# EasyEDA schematic SCH_TS Pico v0.1.json
TITLE: TS Pico - Circuito principal; REV: 0.1; Date: 2022-04-04; Sheet: 1/1; Drawn By: Ricardo Calcagno; Company: .
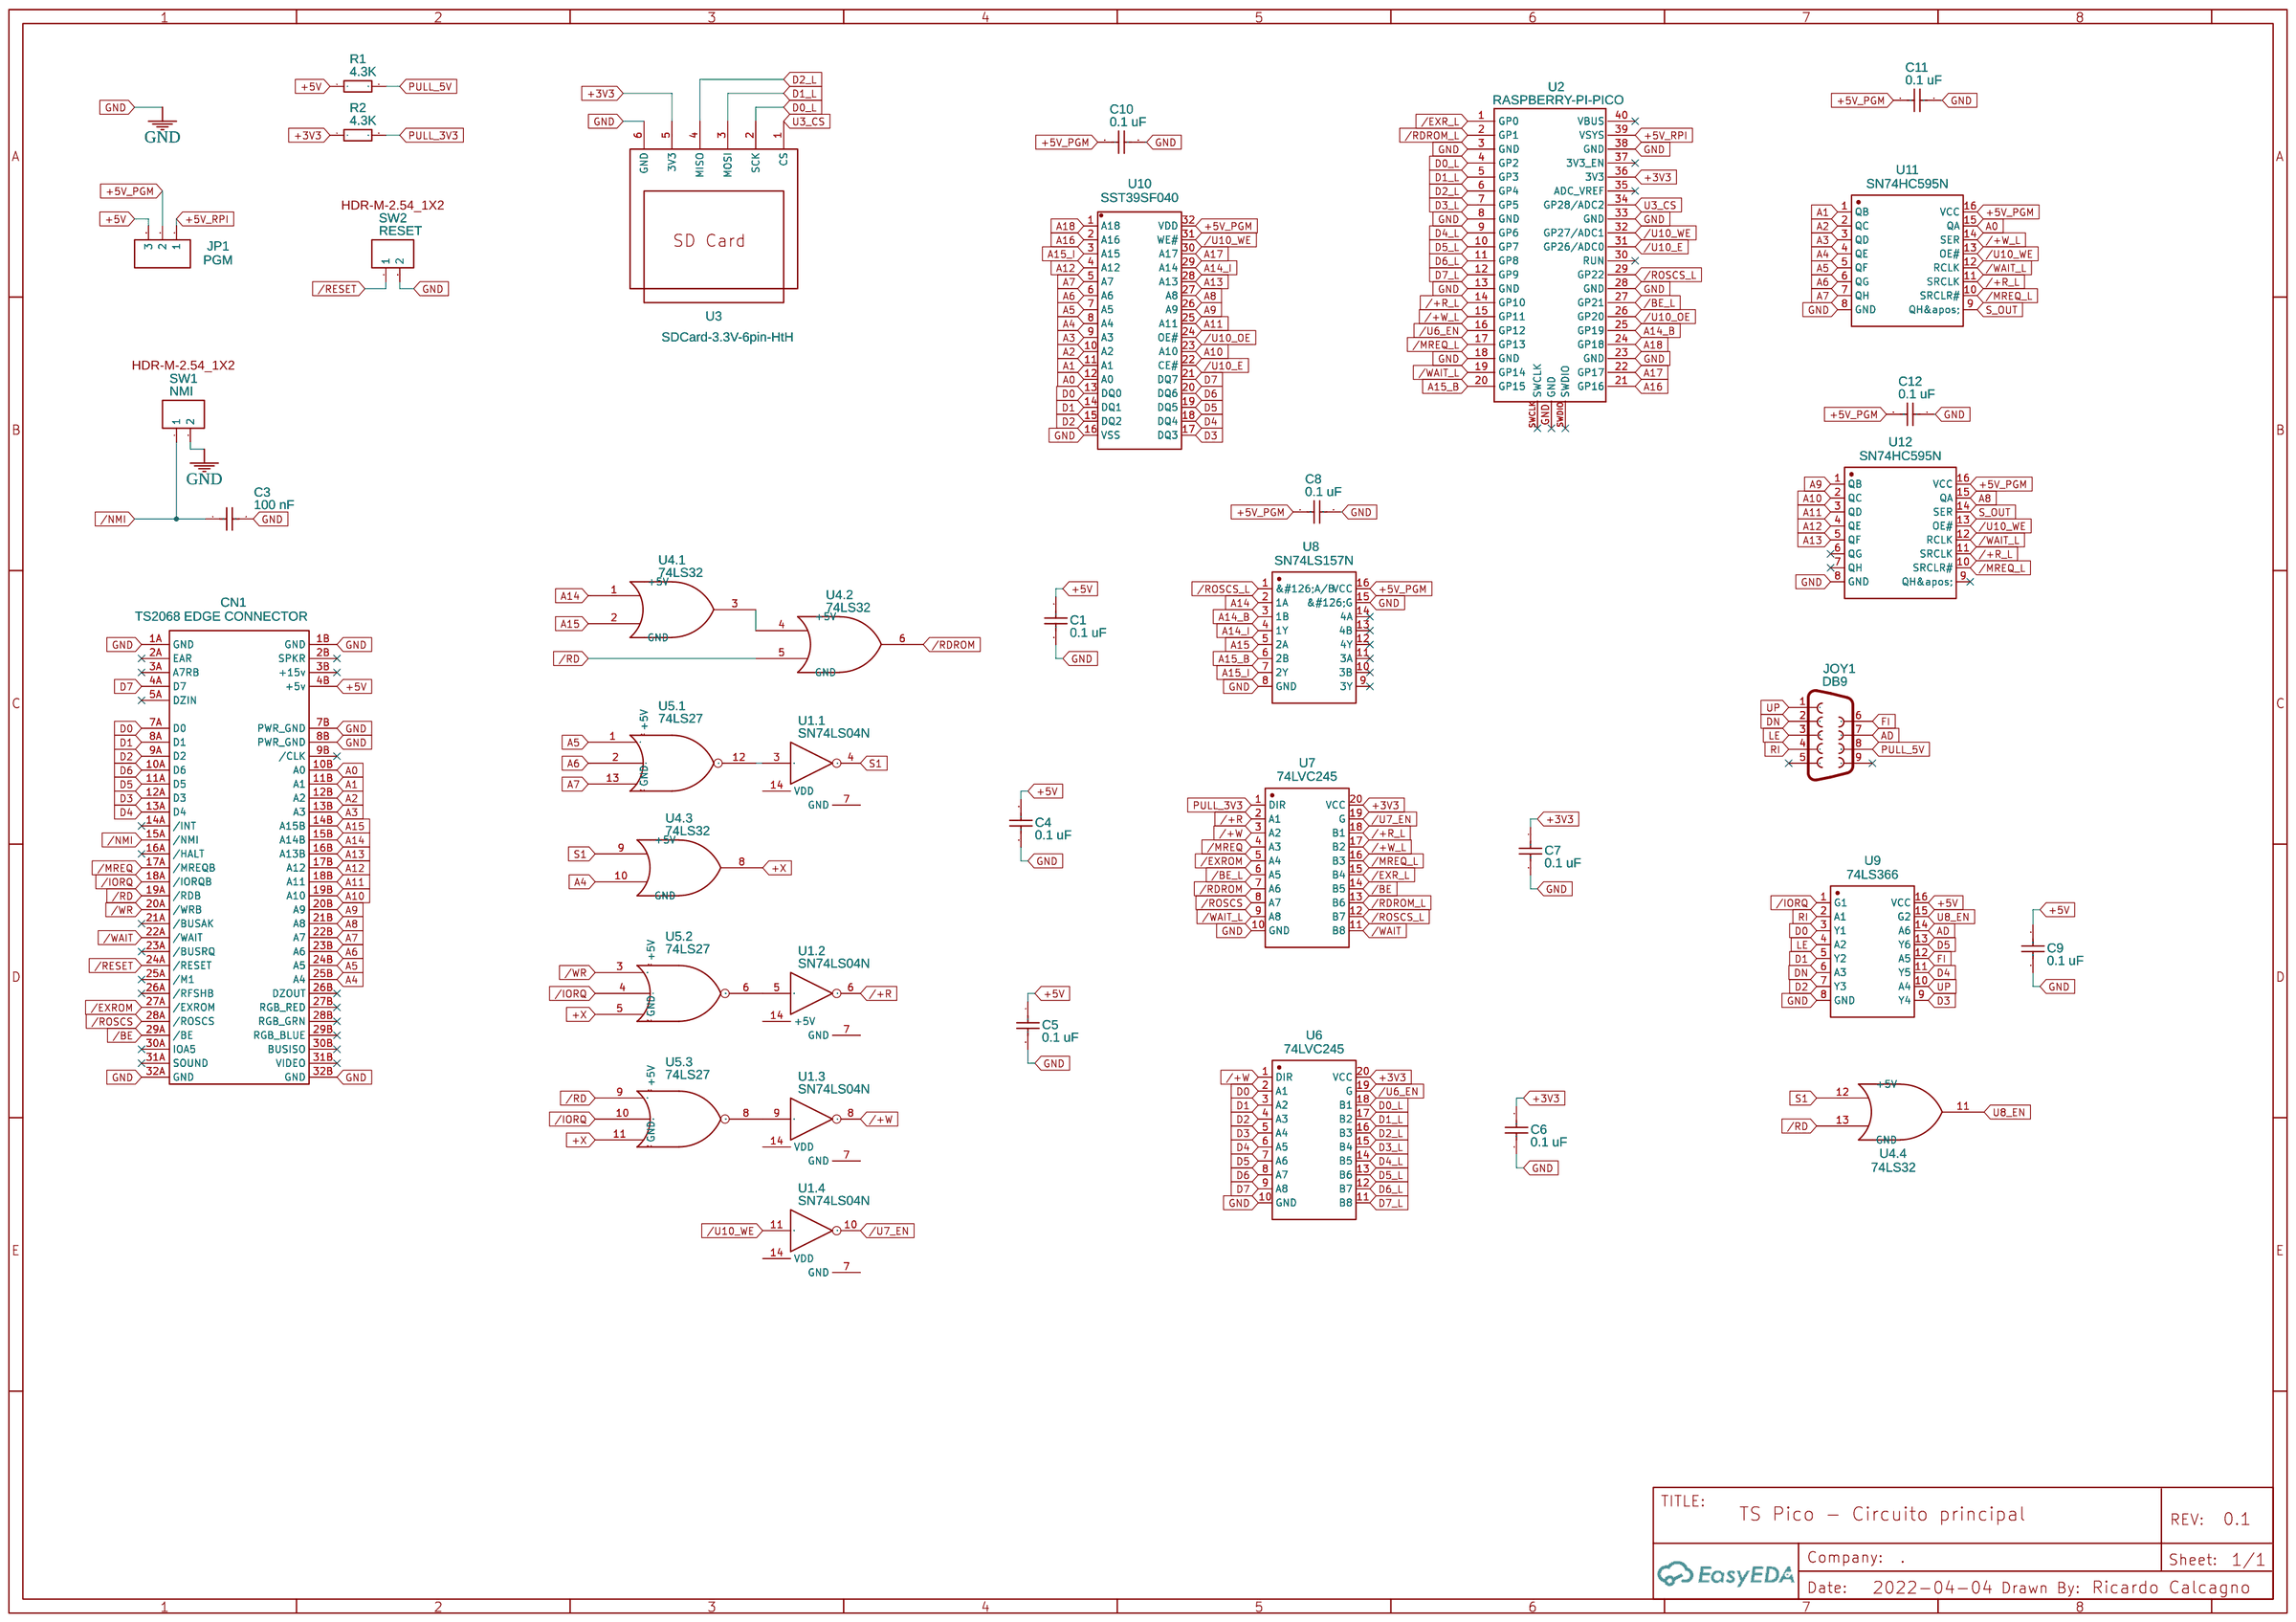
[diagram p0: schematic sheet]

## Parts
C1  0.1 uF  [0.1UF, 50V CAPACITOR]
C3  100 nF  [0.1UF, 50V CAPACITOR]
C4  0.1 uF  [0.1UF, 50V CAPACITOR]
C5  0.1 uF  [0.1UF, 50V CAPACITOR]
C6  0.1 uF  [0.1UF, 50V CAPACITOR]
C7  0.1 uF  [0.1UF, 50V CAPACITOR]
C8  0.1 uF  [0.1UF, 50V CAPACITOR]
C9  0.1 uF  [0.1UF, 50V CAPACITOR]
C10  0.1 uF  [0.1UF, 50V CAPACITOR]
C11  0.1 uF  [0.1UF, 50V CAPACITOR]
C12  0.1 uF  [0.1UF, 50V CAPACITOR]
CN1  TS2068 EDGE CONNECTOR  [CONECTOR TS2068 ROTULADO]
JOY1  DB9  [DB9_MALE]
JP1  PGM  [HDR-M-2.54_1X3]
R1  4.3K  [AXIAL-0.3]
R2  4.3K  [AXIAL-0.3]
SW1  NMI  [HDR-M-2.54_1X2]
SW2  RESET  [HDR-M-2.54_1X2]
U1  SN74LS04N  [DIP14]  (sections 1,2,3,4)
U2  RASPBERRY-PI-PICO  [FT_RASPBERRY-PI-PICO_TH]
U3  SDCard-3.3V-6pin-HtH  [SDCARD-3.,3V-6PIN-HTH]
U4  74LS32  [DIP-14_L17.8-W10.2-P2.54-BL]  (sections 1,2,3,4)
U5  74LS27  [DIP-14_L17.8-W10.2-P2.54-BL]  (sections 1,2,3)
U6  74LVC245  [74LVC245]
U7  74LVC245  [74LVC245]
U8  SN74LS157N  [PDIP-16]
U9  74LS366  [DIP16]
U10  SST39SF040  [DIP32]
U11  SN74HC595N  [DIP-16_L19.8-W6.5-P2.54-LS7.6-BL]
U12  SN74HC595N  [DIP-16_L19.8-W6.5-P2.54-LS7.6-BL]

## Library data of the parts
C1 C3-C12 = Capacitor 10uF (1206): Manufacturer Part: New SchematicLib; Contributor: mpayne002; Package Display: No
CN1 = TS2068 EDGE CONNECTOR - STRAIGHT: Manufacturer: TE Connectivity; Manufacturer Part: 1761468-1; Supplier: Digi-Key; Supplier Part: A102052-ND; link: https://www.digikey.com/product-detail/en/te-connectivity-amp-connectors/1761468-1/A102052-ND/2310803; Contributor: factus10; Package Display: No
JOY1 = DB9: Contributor: SparkFun
JP1 = HDR-M-2.54_1x3: Supplier Part: C180248; Supplier: LCSC; Contributor: LCEDA_Lib
R1 R2 = CF1/6W-4.3KΩ±5% T52: Supplier: LCSC; Manufacturer: CCO; Supplier Part: C119885
SW1 SW2 = HDR-M-2.54_1x2: Supplier Part: C124375; Supplier: LCSC; Contributor: LCEDA_Lib; Package Display: Yes
U1 = SN74LS04N: Hex Inverter; subpart_no: 1
U2 = RASPBERRY-PI-PICO_TH COPY: Contributor: SVKPsycho; Package Display: No
U3 = SDCard-3.3V-6pin-HtH: Manufacturer: Aliexpress; Manufacturer Part: Aliexpress; Contributor: Terhart; Package Display: No
U4 = 8bit-computer-rescue:74LS32: Contributor: Dadofthegoob; subpart_no: 1
U5 = 74LS27: Contributor: KiCad; subpart_no: 2; Package Display: No
U6 U7 = 74LVC245_CG: Supplier Part: C6081; Supplier: LCSC; Manufacturer: PHILIPS; Manufacturer Part: 74LVC245ADB; image: //image.lceda.cn/szlcsc/C6081.jpg; Contributor: kattes; Package Display: No
U8 = SN74LS157N: Manufacturer: Texas Instruments; link: http://www.ti.com/lit/ds/symlink/sn74ls157.pdf; Contributor: Telito_123; Link: http://www.ti.com/lit/ds/symlink/sn74ls157.pdf
U9 = 74LS365AN: Manufacturer Part: SN74LS365AN; Supplier: Digi-Key; Supplier Part: 296-33996-5-ND; Manufacturer: TI; link: https://www.digikey.com/en/products/detail/texas-instruments/SN74LS365AN/1594817; Contributor: factus10
U10 = SST39SF040-70-4C-PHE: Supplier: LCSC; Supplier Part: C220176; Manufacturer: Microchip Tech; Contributor: robdobsn
U11 U12 = SN74HC595N: Supplier: LCSC; Manufacturer: TI; Supplier Part: C78711; JLCPCB Part Class: Extended Part

## Nets
+3V3: C6.1 C7.1 R2.1 U2.36(3V3) U3.5(3V3) U6.20(VCC) U7.20(VCC)
+5V: C1.1 C4.1 C5.1 C9.1 CN1.4B(+5v) JP1.3 R1.1 U9.16(VCC)
+5V_PGM: C8.2 C10.2 C11.2 C12.2 JP1.2 U8.16(VCC) U10.32(VDD) U11.16(VCC) U12.16(VCC)
+5V_RPI: JP1.1 U2.39(VSYS)
GND: C1.2 C3.2 C4.2 C5.2 C6.2 C7.2 C8.1 C9.2 C10.1 C11.1 C12.1 CN1.1A(GND) CN1.1B(GND) CN1.7B(PWR GND) CN1.8B(PWR GND) CN1.32A(GND) CN1.32B(GND) SW1.2 SW2.2 U2.3(GND) U2.8(GND) U2.13(GND) U2.18(GND) U2.23(GND) U2.28(GND) U2.33(GND) U2.38(GND) U3.6(GND) U6.10(GND) U7.10(GND) U8.8(GND) U8.15(&#126;G) U9.8(GND) U10.16(VSS) U11.8(GND) U12.8(GND)
+X: U4.8 U5.5 U5.11
/+R: U1.6(OUT) U7.2(A1)
/+R_L: U2.14(GP10) U7.18(B1) U11.11(SRCLK) U12.11(SRCLK)
/+W: U1.8(OUT) U6.1(DIR) U7.3(A2)
/+W_L: U2.15(GP11) U7.17(B2) U11.14(SER)
/BE: CN1.29A(/BE) U7.14(B5)
/BE_L: U2.27(GP21) U7.6(A5)
/EXR_L: U2.1(GP0) U7.15(B4)
/EXROM: CN1.27A(/EXROM) U7.5(A4)
/IORQ: CN1.18A(/IORQB) U5.4 U5.10 U9.1(G1)
/MREQ: CN1.17A(/MREQB) U7.4(A3)
/MREQ_L: U2.17(GP13) U7.16(B3) U11.10(SRCLR#) U12.10(SRCLR#)
/NMI: C3.1 CN1.15A(/NMI) SW1.1
/RD: CN1.19A(/RDB) U4.5 U4.13 U5.9
/RDROM: U4.6 U7.7(A6)
/RDROM_L: U2.2(GP1) U7.13(B6)
/RESET: CN1.24A(/RESET) SW2.1
/ROSCS: CN1.28A(/ROSCS) U7.8(A7)
/ROSCS_L: U2.29(GP22) U7.12(B7) U8.1(&#126;A/B)
/U6_EN: U2.16(GP12) U6.19(G)
/U7_EN: U1.10(OUT) U7.19(G)
/U10_E: U2.31(GP26/ADC0) U10.22(CE#)
/U10_OE: U2.26(GP20) U10.24(OE#)
/U10_WE: U1.11(IN) U2.32(GP27/ADC1) U10.31(WE#) U11.13(OE#) U12.13(OE#)
/WAIT: CN1.22A(/WAIT) U7.11(B8)
/WAIT_L: U2.19(GP14) U7.9(A8) U11.12(RCLK) U12.12(RCLK)
/WR: CN1.20A(/WRB) U5.3
A0: CN1.10B(A0) U10.12(A0) U11.15(QA)
A1: CN1.11B(A1) U10.11(A1) U11.1(QB)
A2: CN1.12B(A2) U10.10(A2) U11.2(QC)
A3: CN1.13B(A3) U10.9(A3) U11.3(QD)
A4: CN1.25B(A4) U4.10 U10.8(A4) U11.4(QE)
A5: CN1.24B(A5) U5.1 U10.7(A5) U11.5(QF)
A6: CN1.23B(A6) U5.2 U10.6(A6) U11.6(QG)
A7: CN1.22B(A7) U5.13 U10.5(A7) U11.7(QH)
A8: CN1.21B(A8) U10.27(A8) U12.15(QA)
A9: CN1.20B(A9) U10.26(A9) U12.1(QB)
A10: CN1.19B(A10) U10.23(A10) U12.2(QC)
A11: CN1.18B(A11) U10.25(A11) U12.3(QD)
A12: CN1.17B(A12) U10.4(A12) U12.4(QE)
A13: CN1.16B(A13B) U10.28(A13) U12.5(QF)
A14: CN1.15B(A14B) U4.1 U8.2(1A)
A14_B: U2.25(GP19) U8.3(1B)
A14_I: U8.4(1Y) U10.29(A14)
A15: CN1.14B(A15B) U4.2 U8.5(2A)
A15_B: U2.20(GP15) U8.6(2B)
A15_I: U8.7(2Y) U10.3(A15)
A16: U2.21(GP16) U10.2(A16)
A17: U2.22(GP17) U10.30(A17)
A18: U2.24(GP18) U10.1(A18)
AD: JOY1.7 U9.14(A6)
D0: CN1.7A(D0) U6.2(A1) U9.3(Y1) U10.13(DQ0)
D0_L: U2.4(GP2) U3.2(SCK) U6.18(B1)
D1: CN1.8A(D1) U6.3(A2) U9.5(Y2) U10.14(DQ1)
D1_L: U2.5(GP3) U3.3(MOSI) U6.17(B2)
D2: CN1.9A(D2) U6.4(A3) U9.7(Y3) U10.15(DQ2)
D2_L: U2.6(GP4) U3.4(MISO) U6.16(B3)
D3: CN1.12A(D3) U6.5(A4) U9.9(Y4) U10.17(DQ3)
D3_L: U2.7(GP5) U6.15(B4)
D4: CN1.13A(D4) U6.6(A5) U9.11(Y5) U10.18(DQ4)
D4_L: U2.9(GP6) U6.14(B5)
D5: CN1.11A(D5) U6.7(A6) U9.13(Y6) U10.19(DQ5)
D5_L: U2.10(GP7) U6.13(B6)
D6: CN1.10A(D6) U6.8(A7) U10.20(DQ6)
D6_L: U2.11(GP8) U6.12(B7)
D7: CN1.4A(D7) U6.9(A8) U10.21(DQ7)
D7_L: U2.12(GP9) U6.11(B8)
DN: JOY1.2 U9.6(A3)
FI: JOY1.6 U9.12(A5)
LE: JOY1.3 U9.4(A2)
PULL_3V3: R2.2 U7.1(DIR)
PULL_5V: JOY1.8 R1.2
RI: JOY1.4 U9.2(A1)
S1: U1.4(OUT) U4.9 U4.12
S_OUT: U11.9(QH') U12.14(SER)
U3_CS: U2.34(GP28/ADC2) U3.1(CS)
U8_EN: U4.11 U9.15(G2)
UP: JOY1.1 U9.10(A4)
Net-(U1.1-3): U1.3(IN) U5.12
Net-(U1.2-5): U1.5(IN) U5.6
Net-(U1.3-9): U1.9(IN) U5.8
Net-(U4.1-3): U4.3 U4.4

Not connected (* = marked no-connect by the designer): CN1 2A(EAR)* 2B(SPKR)* 3A(A7RB)* 3B(+15v)* 5A(DZIN)* 9B(/CLK)* 14A(/INT)* 16A(/HALT)* 21A(/BUSAK)* 23A(/BUSRQ)* 25A(/M1)* 26A(/RFSHB)* 26B(DZOUT)* 27B(RGB RED)* 28B(RGB GRN)* 29B(RGB BLUE)* 30A(IOA5)* 30B(BUSISO)* 31A(SOUND)* 31B(VIDEO)*; JOY1 5* 9*; U1 7(GND) 14(VDD); U2 30(RUN)* 35(ADC_VREF)* 37(3V3 EN)* 40(VBUS)* GND* SWCLK* SWDIO*; U4 7(GND) 14(+5V); U5 7(GND) 14(+5V); U8 9(3Y)* 10(3B)* 11(3A)* 12(4Y)* 13(4B)* 14(4A)*; U12 6(QG)* 7(QH)* 9(QH')*
